# Altium project novena_battery1.PrjPcb
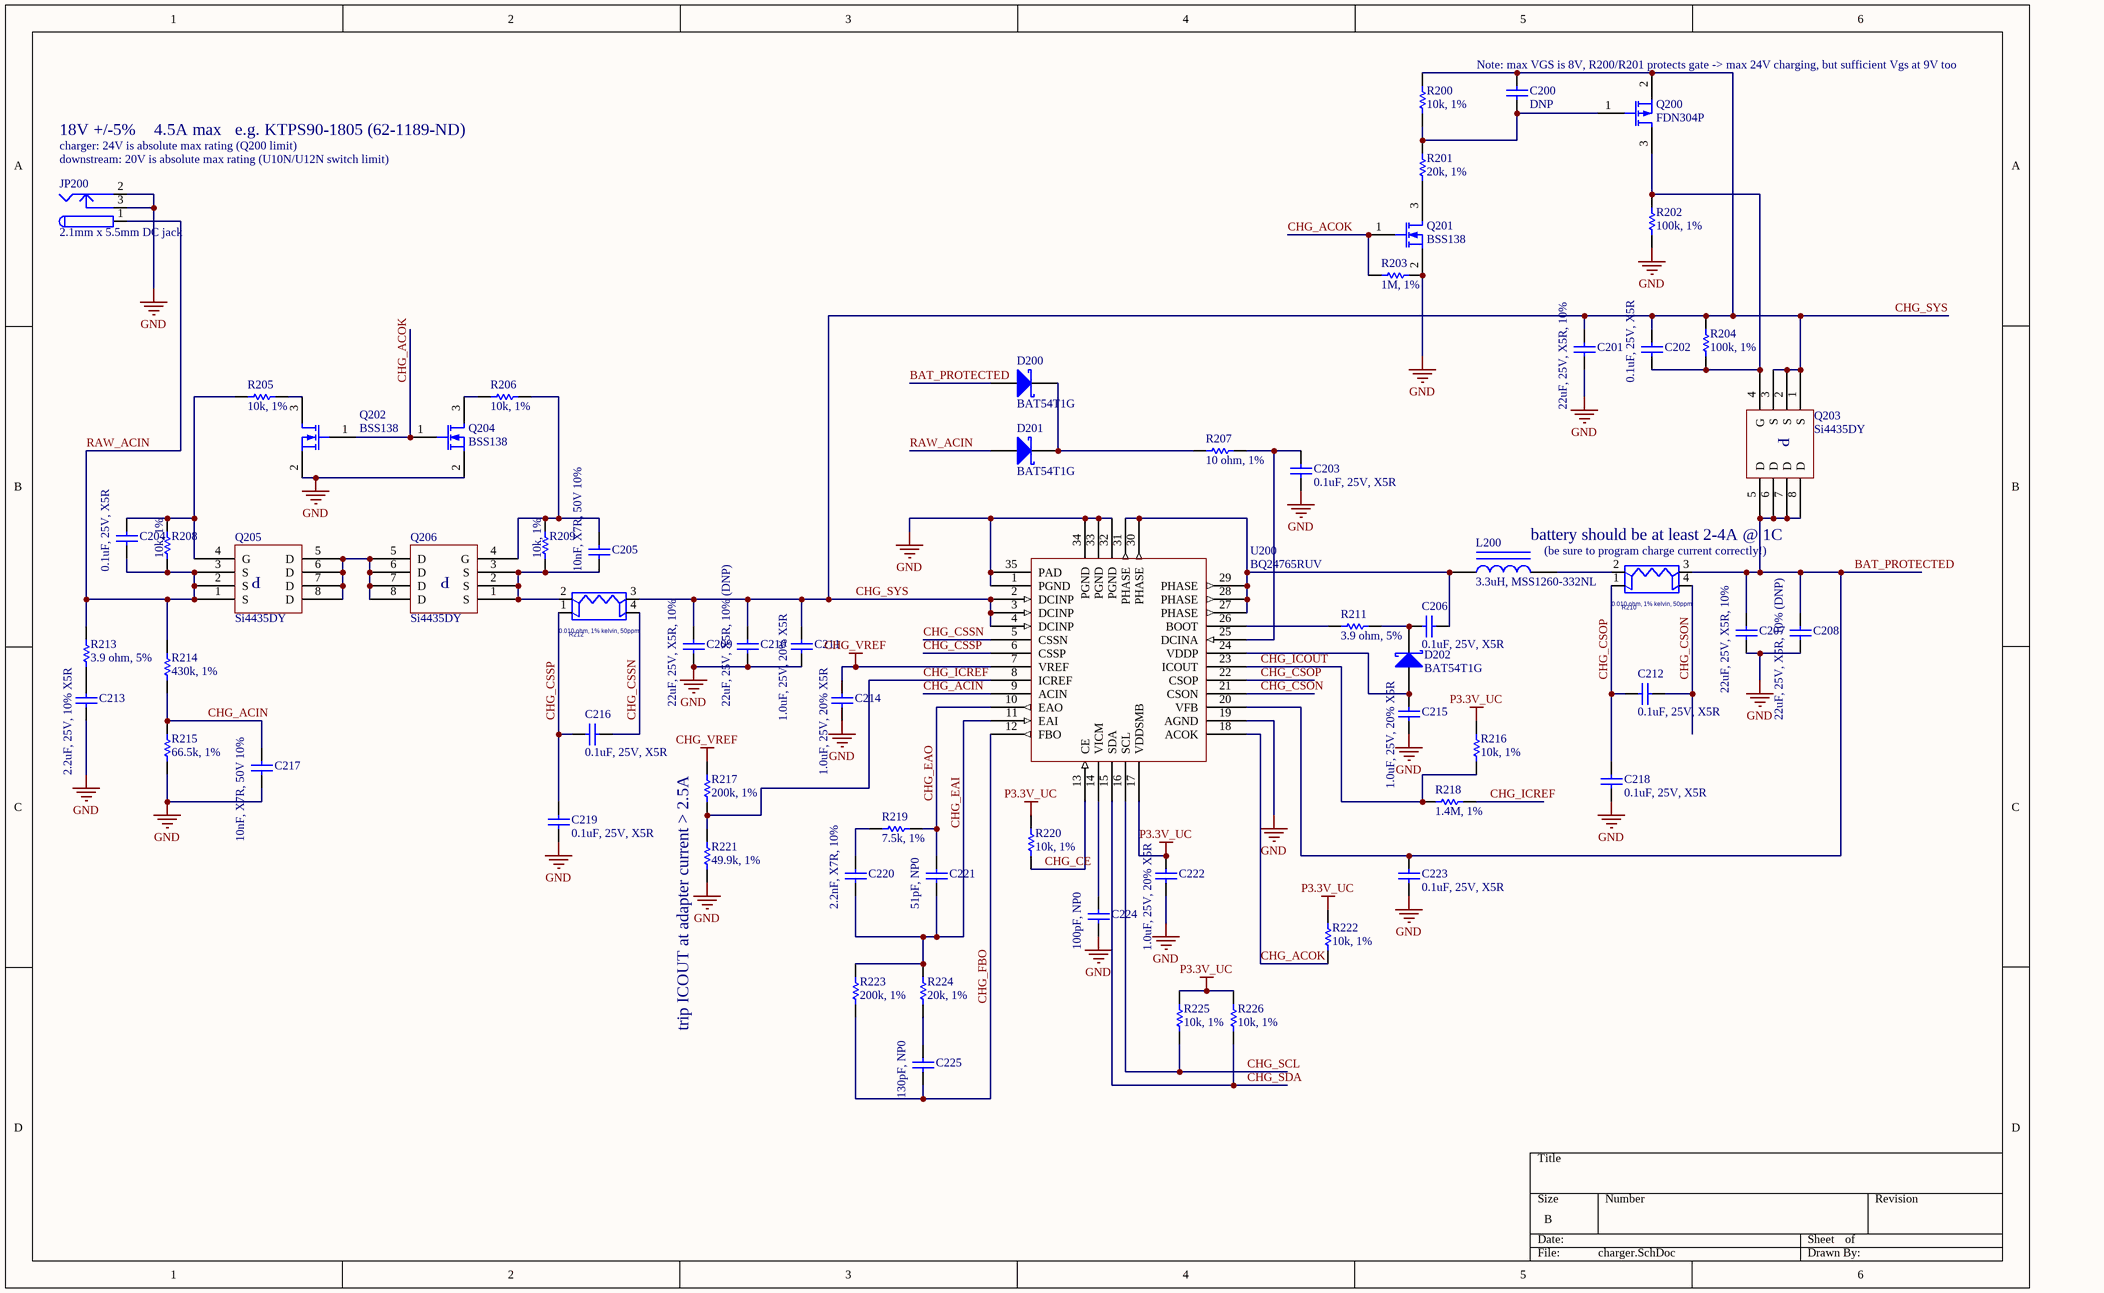
[diagram p0: charger.SchDoc]
3 sheets, 205 parts. Net scope: global (net labels, ports and power ports of the same name join across sheets).
Board file: novena_battery_evt1a.PcbDoc
Sheets:
  charger.SchDoc
  battery.SchDoc
  controller.SchDoc

## Sheet charger.SchDoc
size B

### Parts
C200  DNP  [CAPC1005N]
C201  22uF, 25V, X5R, 10%  [CAPC3225N]
C202  0.1uF, 25V, X5R  [CAPC1005N]
C203  0.1uF, 25V, X5R  [CAPC1005N]
C204  0.1uF, 25V, X5R  [CAPC1005N]
C205  10nF, X7R, 50V 10%  [CAPC1005N]
C206  0.1uF, 25V, X5R  [CAPC1005N]
C207  22uF, 25V, X5R, 10%  [CAPC3225N]
C208  22uF, 25V, X5R, 10% (DNP)  [CAPC3225N]
C209  22uF, 25V, X5R, 10%  [CAPC3225N]
C210  22uF, 25V, X5R, 10% (DNP)  [CAPC3225N]
C211  1.0uF, 25V, 20% X5R  [CAPC1608N]
C212  0.1uF, 25V, X5R  [CAPC1005N]
C213  2.2uF, 25V, 10% X5R  [CAPC1608N]
C214  1.0uF, 25V, 20% X5R  [CAPC1608N]
C215  1.0uF, 25V, 20% X5R  [CAPC1608N]
C216  0.1uF, 25V, X5R  [CAPC1005N]
C217  10nF, X7R, 50V 10%  [CAPC1005N]
C218  0.1uF, 25V, X5R  [CAPC1005N]
C219  0.1uF, 25V, X5R  [CAPC1005N]
C220  2.2nF, X7R, 10%  [CAPC1005N]
C221  51pF, NP0  [CAPC1005N]
C222  1.0uF, 25V, 20% X5R  [CAPC1608N]
C223  0.1uF, 25V, X5R  [CAPC1005N]
C224  100pF, NP0  [CAPC1005N]
C225  130pF, NP0  [CAPC1005N]
D200  BAT54T1G  [SOD123]
D201  BAT54T1G  [SOD123]
D202  BAT54T1G  [SOD123]
JP200  2.1mm x 5.5mm DC jack  [CUI_PJ_002AH_SMT]
L200  3.3uH, MSS1260-332NL  [COILCRAFT_MSS1048]
Q200  FDN304P  [SOT23-3N]
Q201  BSS138  [SOT23-3N]
Q202  BSS138  [SOT23-3N]
Q203  Si4435DY  [SOIC127P600-8AN]
Q204  BSS138  [SOT23-3N]
Q205  Si4435DY  [SOIC127P600-8AN]
Q206  Si4435DY  [SOIC127P600-8AN]
R200  10k, 1%  [RESC1005N]
R201  20k, 1%  [RESC1005N]
R202  100k, 1%  [RESC1005N]
R203  1M, 1%  [RESC1005N]
R204  100k, 1%  [RESC1005N]
R205  10k, 1%  [RESC1005N]
R206  10k, 1%  [RESC1005N]
R207  10 ohm, 1%  [RESC1005N]
R208  10k, 1%  [RESC1005N]
R209  10k, 1%  [RESC1005N]
R210  0.010 ohm, 1% kelvin, 50ppm  [OHMITE_LVK_1206_KELVIN]
R211  3.9 ohm, 5%  [RESC1005N]
R212  0.010 ohm, 1% kelvin, 50ppm  [OHMITE_LVK_1206_KELVIN]
R213  3.9 ohm, 5%  [RESC1005N]
R214  430k, 1%  [RESC1005N]
R215  66.5k, 1%  [RESC1005N]
R216  10k, 1%  [RESC1005N]
R217  200k, 1%  [RESC1005N]
R218  1.4M, 1%  [RESC1005N]
R219  7.5k, 1%  [RESC1005N]
R220  10k, 1%  [RESC1005N]
R221  49.9k, 1%  [RESC1005N]
R222  10k, 1%  [RESC1005N]
R223  200k, 1%  [RESC1005N]
R224  20k, 1%  [RESC1005N]
R225  10k, 1%  [RESC1005N]
R226  10k, 1%  [RESC1005N]
U200  BQ24765RUV  [TI_R-PVQFN-N34]

### Nets
CHG_VREF: C214.1 R217.1 U200.7(VREF)
GND: C201.2 C203.2 C207.2 C208.2 C209.2 C210.2 C211.2 C213.2 C214.2 C215.2 C217.2 C218.1 C219.2 C222.2 C223.1 C224.2 JP200.2 JP200.3 Q201.2(S) Q202.2(S) Q204.2(S) R202.2 R203.1 R215.2 R221.2 U200.1(PGND) U200.19(AGND) U200.32(PGND) U200.33(PGND) U200.34(PGND) U200.35(PAD)
P3.3V_UC: C222.1 R216.1 R220.1 R222.1 R225.1 R226.1 U200.17(VDDSMB)
BAT_PROTECTED: C207.1 C208.1 C223.2 D200.1(A) Q203.5(D) Q203.6(D) Q203.7(D) Q203.8(D) R210.3 U200.20(VFB)
CHG_ACIN: C217.1 R214.2 R215.1 U200.9(ACIN)
CHG_ACOK: Q201.1(G) Q202.1(G) Q204.1(G) R203.2 R222.2 U200.18(ACOK)
CHG_CE: R220.2 U200.13(CE)
CHG_CSON: C212.1 R210.4 U200.21(CSON)
CHG_CSOP: C212.2 C218.2 R210.1 U200.22(CSOP)
CHG_CSSN: C216.2 R212.4 U200.5(CSSN)
CHG_CSSP: C216.1 C219.1 R212.1 U200.6(CSSP)
CHG_EAI: C220.2 C221.2 R223.1 R224.1 U200.11(EAI)
CHG_EAO: C221.1 R219.2 U200.10(EAO)
CHG_FBO: C225.2 R223.2 U200.12(FBO)
CHG_ICOUT: R216.2 R218.2 U200.23(ICOUT)
CHG_ICREF: R217.2 R218.1 R221.1 U200.8(ICREF)
CHG_SCL: R225.2 U200.16(SCL)
CHG_SDA: R226.2 U200.15(SDA)
CHG_SYS: C200.2 C201.1 C202.1 C209.1 C210.1 C211.1 Q200.2(S) Q203.1(S) Q203.2(S) Q203.3(S) R200.1 R204.1 R212.3 U200.2(DCINP) U200.3(DCINP) U200.4(DCINP)
RAW_ACIN: C204.2 D201.1(A) JP200.1 Q205.1(S) Q205.2(S) Q205.3(S) R208.1 R213.1 R214.1
NetC200_1: C200.1 Q200.1(G) R200.2 R201.1
NetC202_2: C202.2 Q200.3(D) Q203.4(G) R202.1 R204.2
NetC203_1: C203.1 R207.2 U200.25(DCINA)
NetC204_1: C204.1 Q205.4(G) R205.1 R208.2
NetC205_1: C205.1 Q206.4(G) R206.2 R209.2
NetC205_2: C205.2 Q206.1(S) Q206.2(S) Q206.3(S) R209.1 R212.2
NetC206_1: C206.1 D202.2(K) R211.2
NetC206_2: C206.2 L200.1 U200.27(PHASE) U200.28(PHASE) U200.29(PHASE) U200.30(PHASE) U200.31(PHASE)
NetC213_1: C213.1 R213.2
NetC215_1: C215.1 D202.1(A) U200.24(VDDP)
NetC220_1: C220.1 R219.1
NetC224_1: C224.1 U200.14(VICM)
NetC225_1: C225.1 R224.2
NetD200_2: D200.2(K) D201.2(K) R207.1
NetL200_2: L200.2 R210.2
NetQ201_3: Q201.3(D) R201.2
NetQ202_3: Q202.3(D) R205.2
NetQ204_3: Q204.3(D) R206.1
NetQ205_5: Q205.5(D) Q205.6(D) Q205.7(D) Q205.8(D) Q206.5(D) Q206.6(D) Q206.7(D) Q206.8(D)
NetR211_1: R211.1 U200.26(BOOT)

### Notes on the sheet
- (near C200) Note: max VGS is 8V, R200/R201 protects gate -> max 24V charging, but sufficient Vgs at 9V too
- 18V +/-5%
- (near JP200) charger: 24V is absolute max rating (Q200 limit)
- (near JP200) downstream: 20V is absolute max rating (U10N/U12N switch limit)
- 4.5A max
- e.g. KTPS90-1805 (62-1189-ND)
- battery should be at least 2-4A @ 1C
- (be sure to program charge current correctly!)
- trip ICOUT at adapter current > 2.5A
- (in symbol Si4435DY) P

### Library data of the parts
C200-C225 = Cap Semi: Capacitor (Semiconductor SIM Model); Published: 8-Jun-2000; LatestRevisionDate: 17-Jul-2002; LatestRevisionNote: Re-released for DXP Platform.; PackageReference: C1206; Publisher: Altium Limited
D200-D202 = D Schottky: Schottky Diode; Code - JEDEC: DO-214-AA; Published: 8-Jun-2000; Publisher: Altium Limited; Revision: July-2002: Re-released for DXP Platform.
JP200 = PWR2.5: Low Voltage Power Supply Connector; Published: 17-Dec-2003; Datasheet: Latest Revision: 09-May-2002; Publisher: Altium Limited
L200 = Inductor Iron: Magnetic-Core Inductor; Published: 24-Mar-1999; LatestRevisionDate: 17-Jul-2002; LatestRevisionNote: Re-released for DXP Platform.; PackageReference: AXIAL-0.9; Publisher: Altium Limited
Q200 = MOSFET-P: P-Channel MOSFET; Published: 8-Jun-2000; LatestRevisionDate: 17-Jul-2002; LatestRevisionNote: Re-released for DXP Platform.; PackageVersion: 1995/1996; PackageReference: E3; Publisher: Altium Limited; PackageDescription: TO, Flat Index; 3 In-Line, Axial Leads; Body Dia. 4.6mm; Lead Dia. 0.5 mm (max)
Q201 Q202 Q204 = MOSFET-N: N-Channel MOSFET; Published: 8-Jun-2000; LatestRevisionDate: 17-Jul-2002; LatestRevisionNote: Re-released for DXP Platform.; PackageVersion: 1995/1996; PackageReference: E3; Publisher: Altium Limited
Q203 Q205 Q206 = Si4435DY: Singre P-channel FET, 8A, 30V
R200 R201 R203 R205-R209 R211 R213-R226 = Res1: Resistor; Value: 100k; Published: 8-Jun-2000; LatestRevisionDate: 17-Jul-2002; LatestRevisionNote: Re-released for DXP Platform.; PackageReference: AXIAL-0.3; Publisher: Altium Limited
R202 R204 = Res1: Resistor; Published: 8-Jun-2000; LatestRevisionDate: 17-Jul-2002; LatestRevisionNote: Re-released for DXP Platform.; PackageReference: AXIAL-0.3; Publisher: Altium Limited; Value: 100k
R210 R212 = RES_4TERM: PART_NUMBER: R00034-001; CDS_LMAN_SYM_OUTLINE: -100,25,100,-75; NEEDS_NO_SIZE: TRUE; PATH: I224; PN: #; OriginalSymbolOrigin: (-100,50); LOCATION: RN32; SEC: 1; XY: (-5650,2000); WATTAGE: 1/2W; PHYS_PAGE: 12; PACK_TYPE: RES1206_4T; MFG_PN: LVK12R020FER; MFG: OHMITE; DRAWING: @BROWNSTONE_LIB.BROWNSTONE(SCH_1):PAGE12; CDS_LIB: resistors; MATERIAL: CH; TOLERANCE: ?; VER: 1; TOL: 1%; ROT: 1; CDS_SEC: 1; CDS_LOCATION: RN32; $TOLERANCE: ?; $SEC: 1; $PN: #; $LOCATION: RN32
U200 = BQ24765RUV: SMBus-controlled battery charger with integrated FETs

## Sheet battery.SchDoc
size B
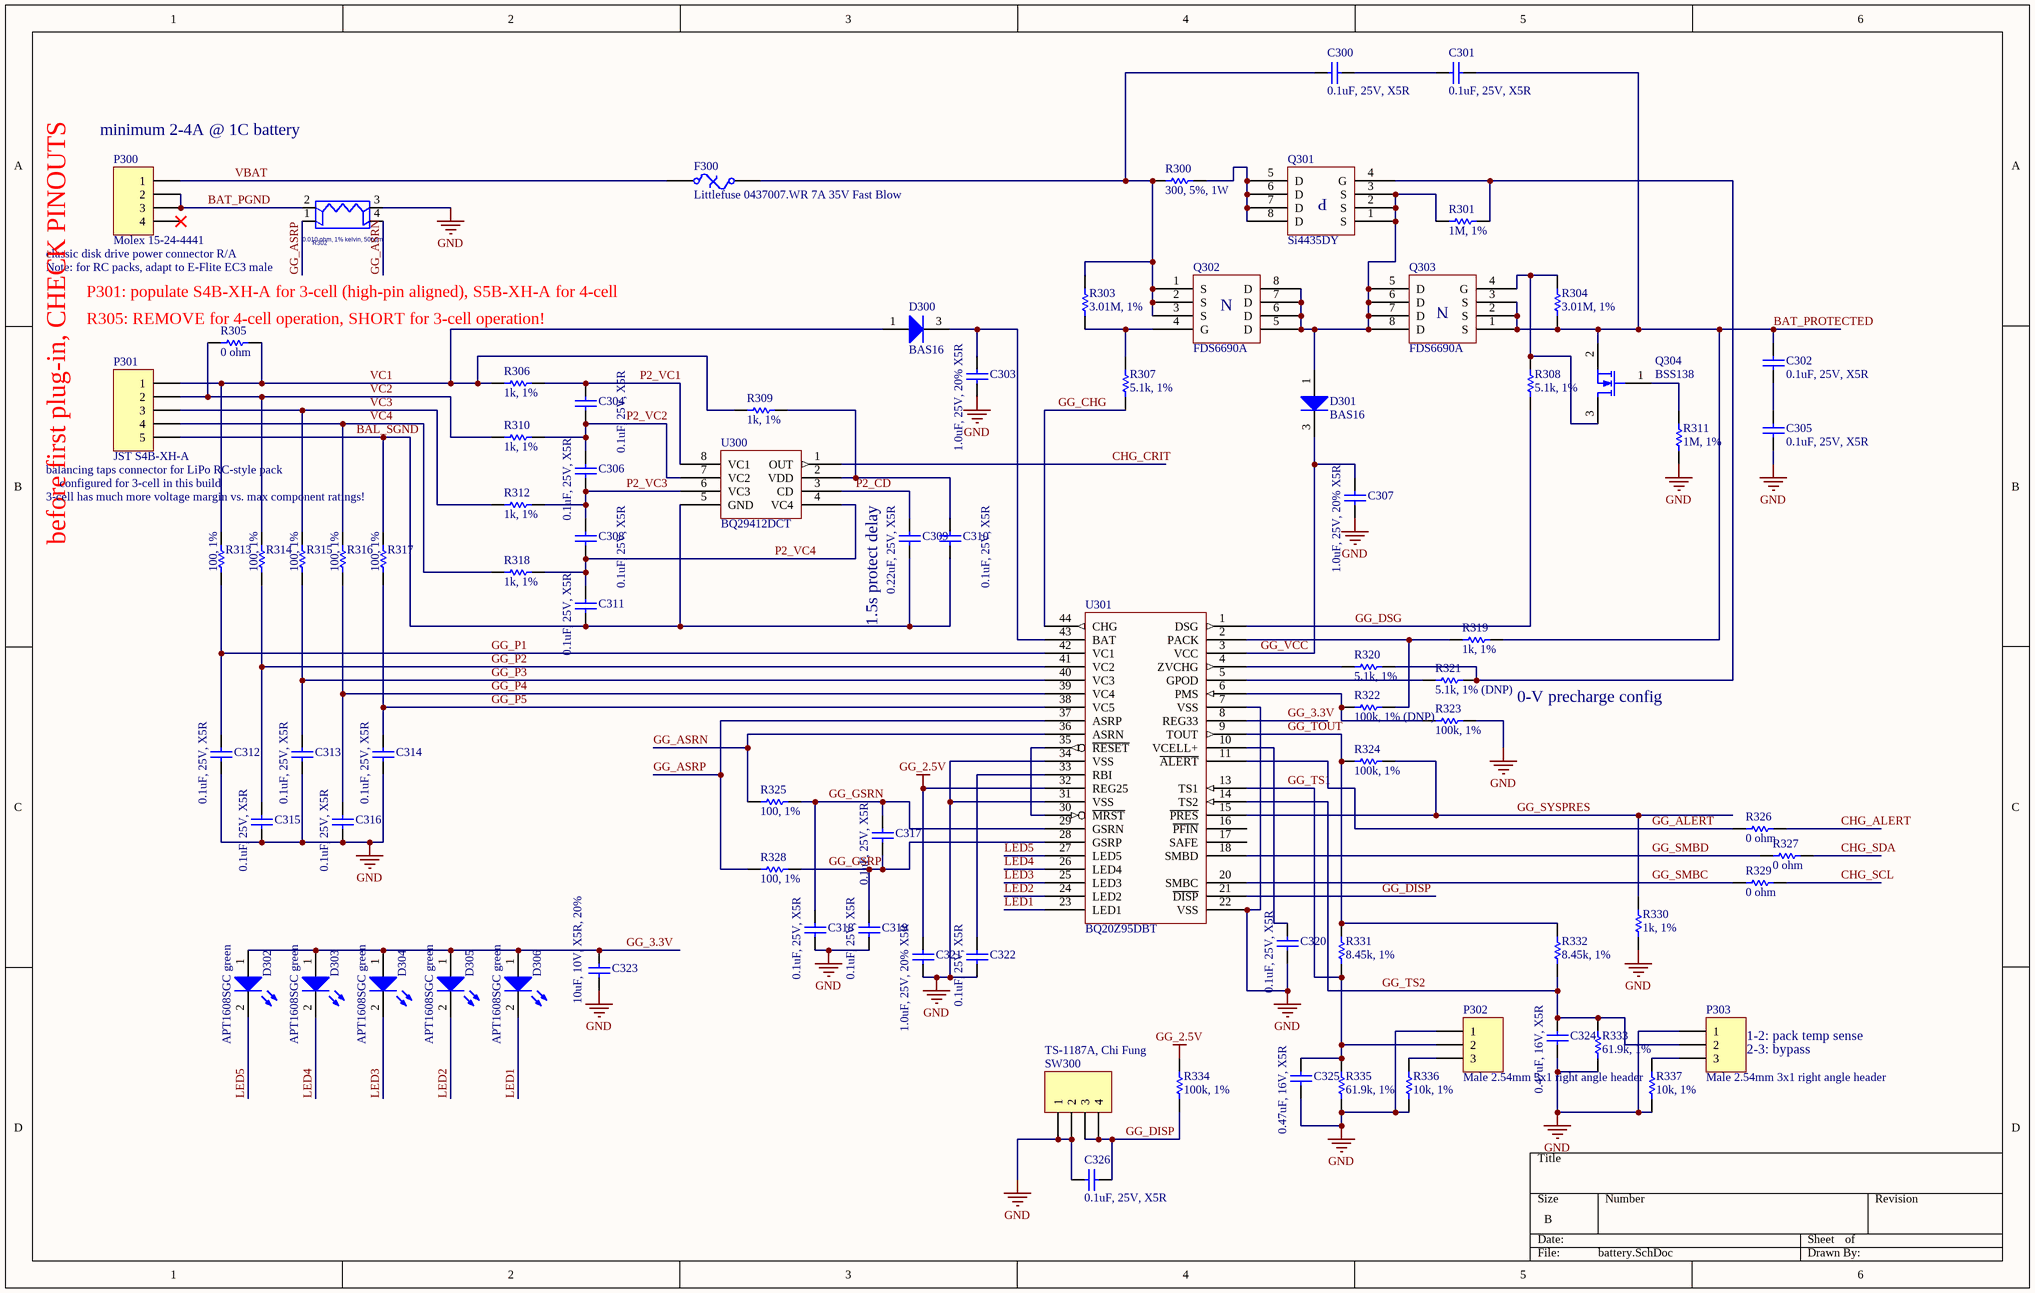
[diagram p1: battery.SchDoc]

### Parts
C300  0.1uF, 25V, X5R  [CAPC1005N]
C301  0.1uF, 25V, X5R  [CAPC1005N]
C302  0.1uF, 25V, X5R  [CAPC1005N]
C303  1.0uF, 25V, 20% X5R  [CAPC1608N]
C304  0.1uF, 25V, X5R  [CAPC1005N]
C305  0.1uF, 25V, X5R  [CAPC1005N]
C306  0.1uF, 25V, X5R  [CAPC1005N]
C307  1.0uF, 25V, 20% X5R  [CAPC1608N]
C308  0.1uF, 25V, X5R  [CAPC1005N]
C309  0.22uF, 25V, X5R  [CAPC1005N]
C310  0.1uF, 25V, X5R  [CAPC1005N]
C311  0.1uF, 25V, X5R  [CAPC1005N]
C312  0.1uF, 25V, X5R  [CAPC1005N]
C313  0.1uF, 25V, X5R  [CAPC1005N]
C314  0.1uF, 25V, X5R  [CAPC1005N]
C315  0.1uF, 25V, X5R  [CAPC1005N]
C316  0.1uF, 25V, X5R  [CAPC1005N]
C317  0.1uF, 25V, X5R  [CAPC1005N]
C318  0.1uF, 25V, X5R  [CAPC1005N]
C319  0.1uF, 25V, X5R  [CAPC1005N]
C320  0.1uF, 25V, X5R  [CAPC1005N]
C321  1.0uF, 25V, 20% X5R  [CAPC1608N]
C322  0.1uF, 25V, X5R  [CAPC1005N]
C323  10uF, 10V, X5R, 20%  [CAPC1608N]
C324  0.47uF, 16V, X5R  [CAPC1005N]
C325  0.47uF, 16V, X5R  [CAPC1005N]
C326  0.1uF, 25V, X5R  [CAPC1005N]
D300  BAS16  [SOT23-3N]
D301  BAS16  [SOT23-3N]
D302  APT1608SGC green  [CD1608-0603]
D303  APT1608SGC green  [CD1608-0603]
D304  APT1608SGC green  [CD1608-0603]
D305  APT1608SGC green  [CD1608-0603]
D306  APT1608SGC green  [CD1608-0603]
F300  Littlefuse 0437007.WR 7A 35V Fast Blow  [RESC3216N]
P300  Molex 15-24-4441  [MOLEX_15-24-4441]
P301  JST S4B-XH-A  [JST_S5B-XH-A_OPT4]
P302  Male 2.54mm 3x1 right angle header  [HDR1X3H]
P303  Male 2.54mm 3x1 right angle header  [HDR1X3H]
Q301  Si4435DY  [SOIC127P600-8AN]
Q302  FDS6690A  [SOIC127P600-8AN]
Q303  FDS6690A  [SOIC127P600-8AN]
Q304  BSS138  [SOT23-3N]
R300  300, 5%, 1W  [RESC6432N]
R301  1M, 1%  [RESC1005N]
R302  0.010 ohm, 1% kelvin, 50ppm  [OHMITE_LVK_1206_KELVIN]
R303  3.01M, 1%  [RESC1005N]
R304  3.01M, 1%  [RESC1005N]
R305  0 ohm  [RESC1005N]
R306  1k, 1%  [RESC1005N]
R307  5.1k, 1%  [RESC1005N]
R308  5.1k, 1%  [RESC1005N]
R309  1k, 1%  [RESC1005N]
R310  1k, 1%  [RESC1005N]
R311  1M, 1%  [RESC1005N]
R312  1k, 1%  [RESC1005N]
R313  100, 1%  [RESC1005N]
R314  100, 1%  [RESC1005N]
R315  100, 1%  [RESC1005N]
R316  100, 1%  [RESC1005N]
R317  100, 1%  [RESC1005N]
R318  1k, 1%  [RESC1005N]
R319  1k, 1%  [RESC1005N]
R320  5.1k, 1%  [RESC1005N]
R321  5.1k, 1% (DNP)  [RESC1005N]
R322  100k, 1% (DNP)  [RESC1005N]
R323  100k, 1%  [RESC1005N]
R324  100k, 1%  [RESC1005N]
R325  100, 1%  [RESC1005N]
R326  0 ohm  [RESC1005N]
R327  0 ohm  [RESC1005N]
R328  100, 1%  [RESC1005N]
R329  0 ohm  [RESC1005N]
R330  1k, 1%  [RESC1005N]
R331  8.45k, 1%  [RESC1005N]
R332  8.45k, 1%  [RESC1005N]
R333  61.9k, 1%  [RESC1005N]
R334  100k, 1%  [RESC1005N]
R335  61.9k, 1%  [RESC1005N]
R336  10k, 1%  [RESC1005N]
R337  10k, 1%  [RESC1005N]
SW300  TS-1187A, Chi Fung  [SWITCH_TS-1187A]
U300  BQ29412DCT  [TSOP65P490-8AN]
U301  BQ20Z95DBT  [TSSOP50P640-44N]

### Nets
GG_2.5V: C321.1 R334.2 U301.32(REG25)
GND: C303.2 C305.1 C307.2 C312.2 C313.2 C314.2 C315.2 C316.2 C318.2 C319.2 C320.2 C321.2 C322.2 C323.2 C324.2 C325.2 C326.2 P302.1 P303.1 R302.3 R311.2 R323.2 R330.2 R333.1 R335.1 R336.1 R337.1 SW300.1 SW300.2 U301.7(VSS) U301.22(VSS) U301.31(VSS) U301.34(VSS)
BAL_SGND: C309.2 C310.2 C311.2 P301.5 R317.1 U300.5(GND)
BAT_PGND: P300.2 P300.3 R302.2
BAT_PROTECTED: C301.1 C302.2 Q303.1(S) Q303.2(S) Q303.3(S) Q304.2(S) R304.2 R319.1
CHG_ALERT: R326.2
CHG_CRIT: U300.1(OUT)
CHG_SCL: R329.2
CHG_SDA: R327.2
GG_3.3V: C323.1 D302.1(A) D303.1(A) D304.1(A) D305.1(A) D306.1(A) U301.8(REG33)
GG_ALERT: R326.1 U301.11(~{ALERT})
GG_ASRN: R302.4 R325.2 U301.36(ASRN)
GG_ASRP: R302.1 R328.2 U301.37(ASRP)
GG_CHG: R307.2 U301.44(CHG)
GG_DISP: C326.1 R334.1 SW300.3 SW300.4 U301.21(~{DISP})
GG_DSG: R308.2 U301.1(DSG)
GG_GSRN: C317.1 C318.1 R325.1 U301.29(GSRN)
GG_GSRP: C317.2 C319.1 R328.1 U301.28(GSRP)
GG_P1: C312.1 R313.2 U301.42(VC1)
GG_P2: C315.1 R314.2 U301.41(VC2)
GG_P3: C313.1 R315.2 U301.40(VC3)
GG_P4: C316.1 R316.2 U301.39(VC4)
GG_P5: C314.1 R317.2 U301.38(VC5)
GG_SMBC: R329.1 U301.20(SMBC)
GG_SMBD: R327.1 U301.18(SMBD)
GG_SYSPRES: R324.2 R330.1 U301.15(~{PRES})
GG_TOUT: R324.1 R331.2 R332.2 U301.9(TOUT)
GG_TS1: C325.1 P302.2 R331.1 R335.2 U301.13(TS1)
GG_TS2: C324.1 P303.2 R332.1 R333.2 U301.14(TS2)
GG_VCC: C307.1 D301.3(K) U301.3(VCC)
LED1: D306.2(K) U301.23(LED1)
LED2: D305.2(K) U301.24(LED2)
LED3: D304.2(K) U301.25(LED3)
LED4: D303.2(K) U301.26(LED4)
LED5: D302.2(K) U301.27(LED5)
P2_CD: C309.1 U300.3(CD)
P2_VC1: C304.1 R306.2 U300.8(VC1)
P2_VC2: C304.2 C306.1 R310.2 U300.7(VC2)
P2_VC3: C306.2 C308.1 R312.2 U300.6(VC3)
P2_VC4: C308.2 C311.1 R318.2 U300.4(VC4)
VBAT: F300.1 P300.1
VC1: D300.1(A) P301.1 R305.2 R306.1 R309.1 R313.1
VC2: P301.2 R305.1 R310.1 R314.1
VC3: P301.3 R312.1 R315.1
VC4: P301.4 R316.1 R318.1
NetC300_1: C300.1 C301.2
NetC300_2: C300.2 F300.2 Q302.1(S) Q302.2(S) Q302.3(S) R300.2 R303.1
NetC302_1: C302.1 C305.2
NetC303_1: C303.1 D300.3(K) U301.43(BAT)
NetC310_1: C310.1 R309.2 U300.2(VDD)
NetC320_1: C320.1 U301.10(VCELL+)
NetC322_1: C322.1 U301.33(RBI)
NetD301_1: D301.1(A) Q301.1(S) Q301.2(S) Q301.3(S) Q302.5(D) Q302.6(D) Q302.7(D) Q302.8(D) Q303.5(D) Q303.6(D) Q303.7(D) Q303.8(D) R301.2
NetP302_3: P302.3 R336.2
NetP303_3: P303.3 R337.2
NetQ301_4: Q301.4(G) R301.1 R320.1 R321.1
NetQ301_5: Q301.5(D) Q301.6(D) Q301.7(D) Q301.8(D) R300.1
NetQ302_4: Q302.4(G) R303.2 R307.1
NetQ303_4: Q303.4(G) Q304.3(D) R304.1 R308.1
NetQ304_1: Q304.1(G) R311.1
NetR319_2: R319.2 R322.2 U301.2(PACK)
NetR320_2: R320.2 U301.4(ZVCHG)
NetR321_2: R321.2 U301.5(GPOD)
NetR322_1: R322.1 R323.1 U301.6(PMS)
NetU301_30: U301.30(~{MRST}) U301.35(~{RESET})

Not connected (* = marked no-connect by the designer): P300 4*; U301 16(~{PFIN}) 17(SAFE)

### Notes on the sheet
- (near P300) minimum 2-4A @ 1C battery
- (near P300) classic disk drive power connector R/A
- Note: for RC packs, adapt to E-Flite EC3 male
- P301: populate S4B-XH-A for 3-cell (high-pin aligned), S5B-XH-A for 4-cell
- (near R305) R305: REMOVE for 4-cell operation, SHORT for 3-cell operation!
- (near P301) balancing taps connector for LiPo RC-style pack
- 3-cell has much more voltage margin vs. max component ratings!
- configured for 3-cell in this build
- before first plug-in, CHECK PINOUTS
- (near C309) 1.5s protect delay
- 0-V precharge config
- (near P303) 1-2: pack temp sense
- (near P303) 2-3: bypass
- (in symbol FDS6690A) N
- (in symbol Si4435DY) P

### Library data of the parts
C300-C326 = Cap Semi: Capacitor (Semiconductor SIM Model); Published: 8-Jun-2000; LatestRevisionDate: 17-Jul-2002; LatestRevisionNote: Re-released for DXP Platform.; PackageReference: C1206; Publisher: Altium Limited
D300 D301 = Diode 1N4148: Silicon diode; Published: 8-Jun-2000; LatestRevisionDate: 17-Jul-2002; LatestRevisionNote: Re-released for DXP Platform.; DatasheetVersion: 1997; PackageReference: DO-35; Publisher: Altium Limited; PackageDescription: Diode, Axial; Body 3.8 x 1.9 mm (LxDia. max), Lead Dia. 0.53 mm (max); Code_JEDEC: DO-204-AH; ComponentLink1Description: Manufacturer Link; ComponentLink1URL: http://www.fairchildsemi.com/; ComponentLink2Description: Datasheet; ComponentLink2URL: http://www.fairchildsemi.com/ds/1N%2F1N4148.pdf
D302-D306 = LED2: Typical RED, GREEN, YELLOW, AMBER GaAs LED; Published: 8-Jun-2000; LatestRevisionDate: 17-Jul-2002; LatestRevisionNote: Re-released for DXP Platform.; PackageVersion: Feb-2002; PackageReference: 3.2X1.6X1.1; Publisher: Altium Limited
F300 = Fuse Thermal: Thermal Fuse; Published: 24-Mar-1999; Revision: July-2002: Re-released for DXP Platform.; Publisher: Altium Limited
P300 = Header 4: Classic PC hard drive power connector, RA; LatestRevisionDate: 17-Jul-2002; LatestRevisionNote: Re-released for DXP Platform.; Publisher: Altium Limited
P301 = Header 5: JST S4B-XH-A 2.5mm RA connector, stuffed in 5-pin slot, high pin aligned; LatestRevisionDate: 17-Jul-2002; LatestRevisionNote: Re-released for DXP Platform.; Publisher: Altium Limited
P302 P303 = Header 3H: Header, 3-Pin, Right Angle; LatestRevisionDate: 17-Jul-2002; LatestRevisionNote: Re-released for DXP Platform.; Publisher: Altium Limited
Q301 = Si4435DY: Singre P-channel FET, 8A, 30V
Q302 Q303 = FDS6690A: Single N-channel FET, 11A, 30V
Q304 = MOSFET-N: N-Channel MOSFET; Published: 8-Jun-2000; LatestRevisionDate: 17-Jul-2002; LatestRevisionNote: Re-released for DXP Platform.; PackageVersion: 1995/1996; PackageReference: E3; Publisher: Altium Limited
R300 R301 R303-R321 R325-R333 R335-R337 = Res1: Resistor; Value: 100k; Published: 8-Jun-2000; LatestRevisionDate: 17-Jul-2002; LatestRevisionNote: Re-released for DXP Platform.; PackageReference: AXIAL-0.3; Publisher: Altium Limited
R302 = RES_4TERM: as R210 on sheet charger; MATERIAL: CH; TOLERANCE: ?; VER: 1; TOL: 1%; ROT: 1; CDS_SEC: 1; CDS_LOCATION: RN32; $TOLERANCE: ?; $SEC: 1; $PN: #; $LOCATION: RN32
R322-R324 R334 = Res1: Resistor; Published: 8-Jun-2000; LatestRevisionDate: 17-Jul-2002; LatestRevisionNote: Re-released for DXP Platform.; PackageReference: AXIAL-0.3; Publisher: Altium Limited; Value: 100k
SW300 = Header 4: Chi Fung TS-1187A; LatestRevisionDate: 17-Jul-2002; LatestRevisionNote: Re-released for DXP Platform.; Publisher: Altium Limited
U300 = BQ2941XDCT: Voltage protection for 2-,3-, and 4-cell LiIon batteries (2nd level)
U301 = BQ20Z95DBT: SBS 1.1-Compliant Gas Gauge and Protection with Impedance Track (TM)

## Sheet controller.SchDoc
size B
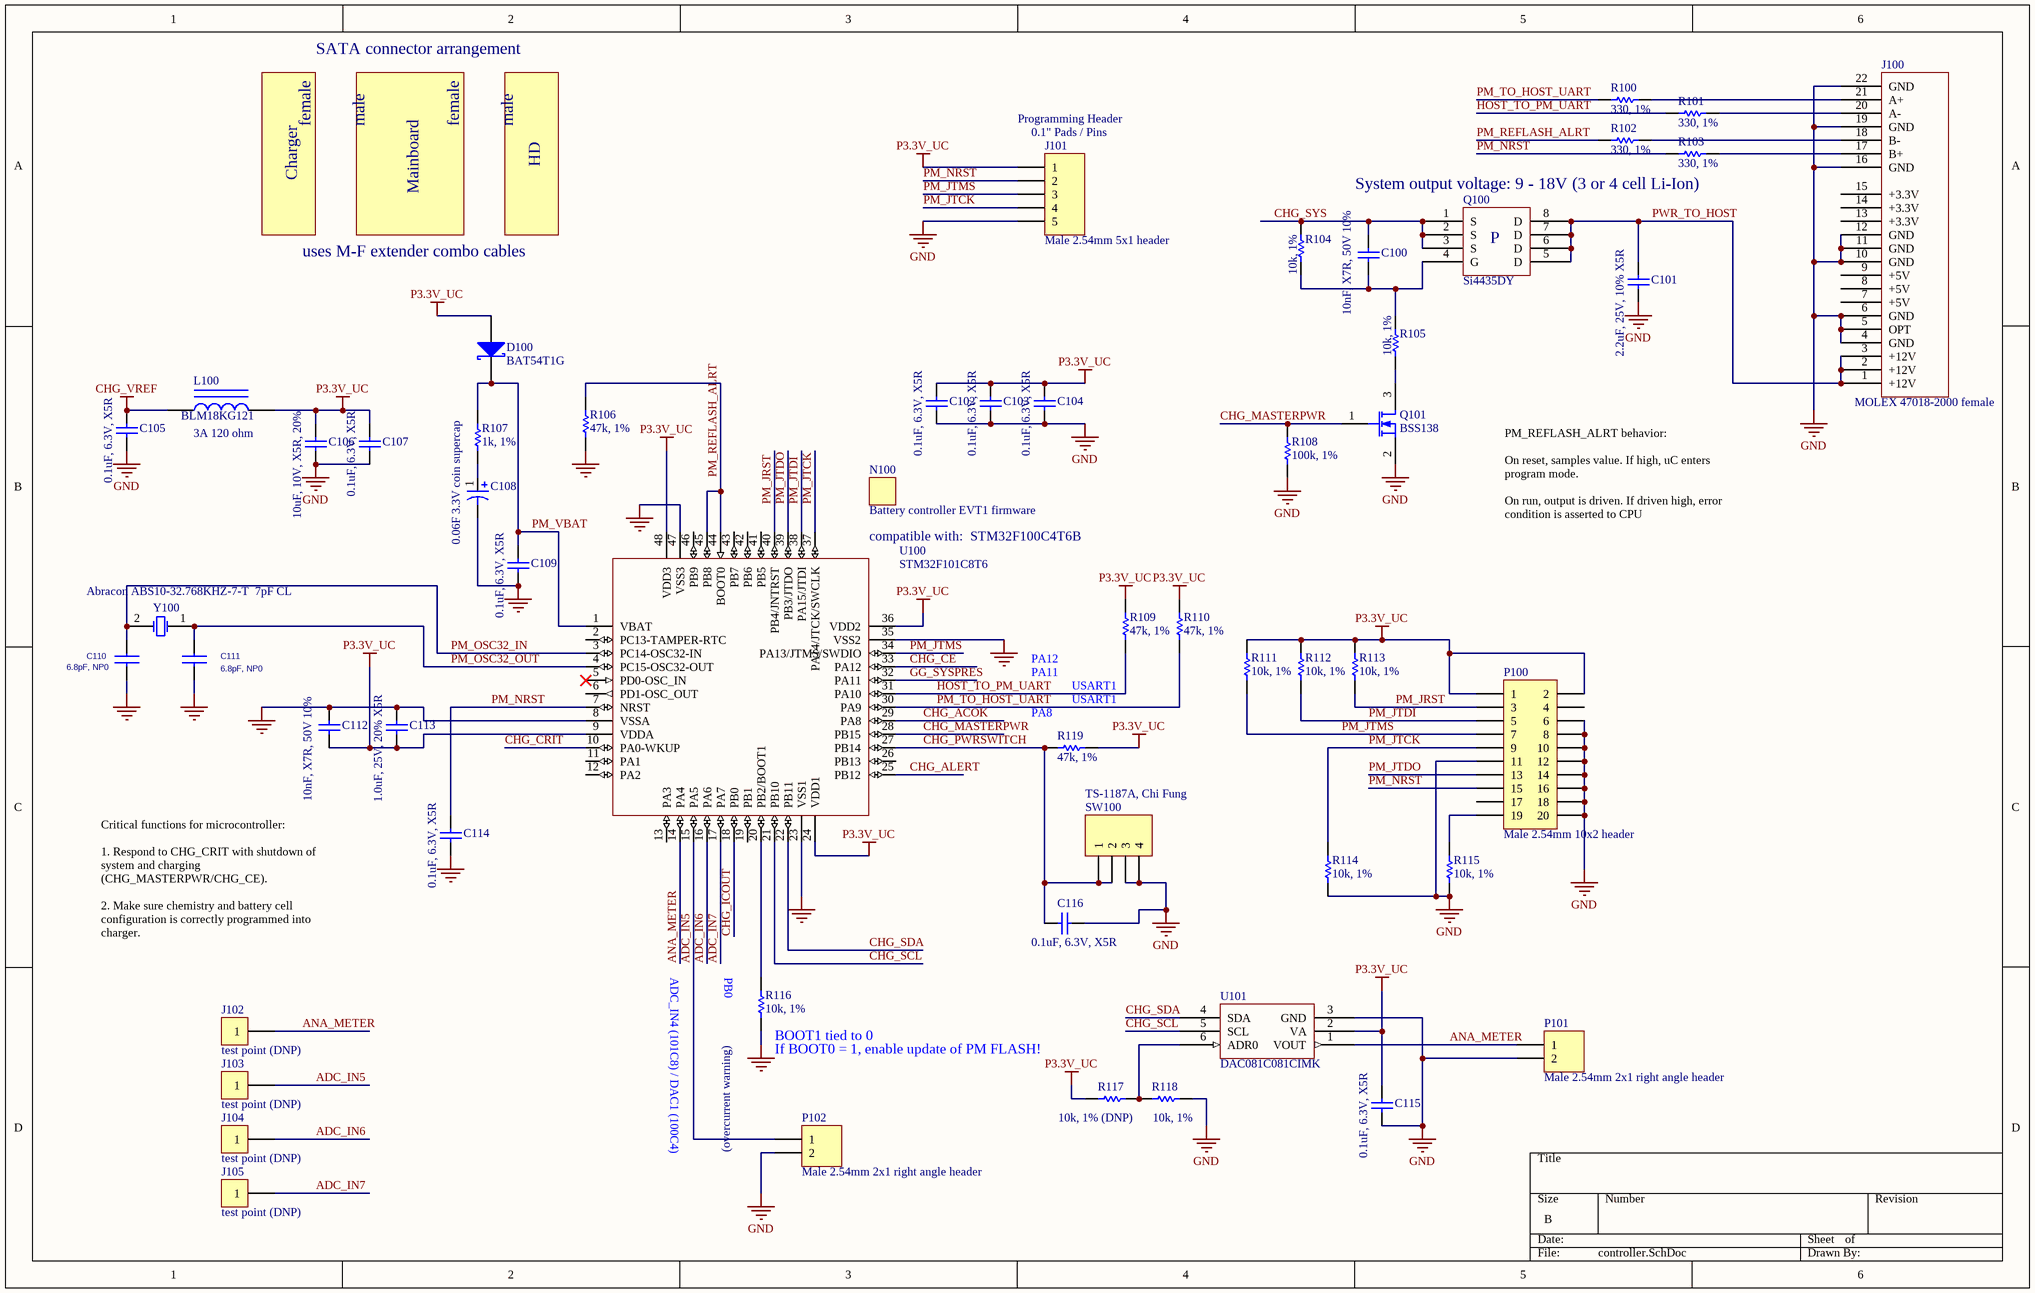
[diagram p2: controller.SchDoc]

### Parts
C100  10nF, X7R, 50V 10%  [CAPC1005N]
C101  2.2uF, 25V, 10% X5R  [CAPC1608N]
C102  0.1uF, 6.3V, X5R  [CAPC0603N_B]
C103  0.1uF, 6.3V, X5R  [CAPC0603N_B]
C104  0.1uF, 6.3V, X5R  [CAPC0603N_B]
C105  0.1uF, 6.3V, X5R  [CAPC0603N_B]
C106  10uF, 10V, X5R, 20%  [CAPC1608N]
C107  0.1uF, 6.3V, X5R  [CAPC0603N_B]
C108  0.06F 3.3V coin supercap  [TAIYO_YUDEN_PAS414HR-VA5R]
C109  0.1uF, 6.3V, X5R  [CAPC0603N_B]
C110  6.8pF, NP0  [CAPC1005N]
C111  6.8pF, NP0  [CAPC1005N]
C112  10nF, X7R, 50V 10%  [CAPC1005N]
C113  1.0uF, 25V, 20% X5R  [CAPC1608N]
C114  0.1uF, 6.3V, X5R  [CAPC0603N_B]
C115  0.1uF, 6.3V, X5R  [CAPC0603N_B]
C116  0.1uF, 6.3V, X5R  [CAPC0603N_B]
D100  BAT54T1G  [SOD123]
J100  MOLEX 47018-2000 female  [SATA_MOLEX_47018_2000]
J101  Male 2.54mm 5x1 header  [HDR1X5]
J102  test point (DNP)  [TP_SMT_38mil]
J103  test point (DNP)  [TP_SMT_38mil]
J104  test point (DNP)  [TP_SMT_38mil]
J105  test point (DNP)  [TP_SMT_38mil]
L100  BLM18KG121  value 3A 120 ohm  [INDC1608AN]
N100  Battery controller EVT1 firmware
P100  Male 2.54mm 10x2 header  [HDR2X10]
P101  Male 2.54mm 2x1 right angle header  [HDR1X2H]
P102  Male 2.54mm 2x1 right angle header  [HDR1X2H]
Q100  Si4435DY  [SOIC127P600-8AN]
Q101  BSS138  [SOT23-3N]
R100  330, 1%  [RESC1005N]
R101  330, 1%  [RESC1005N]
R102  330, 1%  [RESC1005N]
R103  330, 1%  [RESC1005N]
R104  10k, 1%  [RESC1005N]
R105  10k, 1%  [RESC1005N]
R106  47k, 1%  [RESC1005N]
R107  1k, 1%  [RESC1005N]
R108  100k, 1%  [RESC1005N]
R109  47k, 1%  [RESC1005N]
R110  47k, 1%  [RESC1005N]
R111  10k, 1%  [RESC1005N]
R112  10k, 1%  [RESC1005N]
R113  10k, 1%  [RESC1005N]
R114  10k, 1%  [RESC1005N]
R115  10k, 1%  [RESC1005N]
R116  10k, 1%  [RESC1005N]
R117  10k, 1% (DNP)  [RESC1005N]
R118  10k, 1%  [RESC1005N]
R119  47k, 1%  [RESC1005N]
SW100  TS-1187A, Chi Fung  [SWITCH_TS-1187A]
U100  STM32F101C8T6  [TSQFP50P900X900-48N]
U101  DAC081C081CIMK  [SOT26A-6N]
Y100  Abracon ABS10-32.768KHZ-7-T  7pF CL  [ABS10-32.768KHZ]

### Nets
CHG_VREF: C105.1 L100.1
GND: C101.2 C102.2 C103.2 C104.2 C105.2 C106.2 C107.2 C108.2 C109.2 C110.2 C111.2 C112.1 C113.1 C114.2 C115.2 C116.1 J100.4(GND) J100.5(OPT) J100.6(GND) J100.10(GND) J100.11(GND) J100.12(GND) J100.16(GND) J100.19(GND) J100.22(GND) J101.5 P100.6 P100.8 P100.10 P100.11 P100.12 P100.14 P100.16 P100.18 P100.20 P101.2 P102.2 Q101.2(S) R106.1 R108.1 R114.1 R115.1 R116.1 R118.2 SW100.3 SW100.4 U100.8(VSSA) U100.23(VSS1) U100.35(VSS2) U100.47(VSS3) U101.3(GND)
P3.3V_UC: C102.1 C103.1 C104.1 C106.1 C107.1 C112.2 C113.2 C115.1 D100.1(A) J101.1 L100.2 P100.1 P100.2 R109.2 R110.2 R111.2 R112.2 R113.2 R117.1 R119.2 U100.9(VDDA) U100.24(VDD1) U100.36(VDD2) U100.48(VDD3) U101.2(VA)
ADC_IN5: J103.1 P102.1 U100.15(PA5)
ADC_IN6: J104.1 U100.16(PA6)
ADC_IN7: J105.1 U100.17(PA7)
ANA_METER: J102.1 P101.1 U100.14(PA4) U101.1(VOUT)
CHG_ACOK: U100.29(PA8)
CHG_ALERT: U100.25(PB12)
CHG_CE: U100.33(PA12)
CHG_CRIT: U100.10(PA0-WKUP)
CHG_ICOUT: U100.18(PB0)
CHG_MASTERPWR: Q101.1(G) R108.2 U100.28(PB15)
CHG_PWRSWITCH: C116.2 R119.1 SW100.1 SW100.2 U100.27(PB14)
CHG_SCL: U100.21(PB10) U101.5(SCL)
CHG_SDA: U100.22(PB11) U101.4(SDA)
CHG_SYS: C100.1 Q100.1(S) Q100.2(S) Q100.3(S) R104.2
GG_SYSPRES: U100.32(PA11)
HOST_TO_PM_UART: R101.1 R109.1 U100.31(PA10)
PM_JRST: P100.3 R113.1 U100.40(PB4/JNTRST)
PM_JTCK: J101.4 P100.9 R114.2 U100.37(PA14/JTCK/SWCLK)
PM_JTDI: P100.5 R112.1 U100.38(PA15/JTDI)
PM_JTDO: P100.13 U100.39(PB3/JTDO)
PM_JTMS: J101.3 P100.7 R111.1 U100.34(PA13/JTMS/SWDIO)
PM_NRST: C114.1 J101.2 P100.15 R103.1 U100.7(NRST)
PM_OSC32_IN: C110.1 U100.3(PC14-OSC32-IN) Y100.2(OSC2)
PM_OSC32_OUT: C111.1 U100.4(PC15-OSC32-OUT) Y100.1(OSC1)
PM_REFLASH_ALRT: R102.1 R106.2 U100.44(BOOT0) U100.45(PB8)
PM_TO_HOST_UART: R100.1 R110.1 U100.30(PA9)
PM_VBAT: C109.1 D100.2(K) R107.2 U100.1(VBAT)
PWR_TO_HOST: C101.1 J100.1(+12V) J100.2(+12V) J100.3(+12V) Q100.5(D) Q100.6(D) Q100.7(D) Q100.8(D)
NetC100_2: C100.2 Q100.4(G) R104.1 R105.2
NetC108_1: C108.1 R107.1
NetJ100_17: J100.17(B+) R103.2
NetJ100_18: J100.18(B-) R102.2
NetJ100_20: J100.20(A-) R101.2
NetJ100_21: J100.21(A+) R100.2
NetP100_19: P100.19 R115.2
NetQ101_3: Q101.3(D) R105.1
NetR116_2: R116.2 U100.20(PB2/BOOT1)
NetR117_2: R117.2 R118.1 U101.6(ADR0)

Not connected (* = marked no-connect by the designer): J100 7(+5V) 8(+5V) 9(+5V) 13(+3.3V) 14(+3.3V) 15(+3.3V); P100 4 17; U100 2(PC13-TAMPER-RTC) 5(PD0-OSC_IN)* 6(PD1-OSC_OUT) 11(PA1) 12(PA2) 13(PA3) 19(PB1) 26(PB13) 41(PB5) 42(PB6) 43(PB7) 46(PB9)

### Notes on the sheet
- SATA connector arrangement
- female
- male
- HD
- (near J101) Programming Header
- (near J101) 0.1" Pads / Pins
- Charger
- Mainboard
- System output voltage: 9 - 18V (3 or 4 cell Li-Ion)
- uses M-F extender combo cables
- (near U100) compatible with:  STM32F100C4T6B
- PM_REFLASH_ALRT behavior:
  On reset, samples value. If high, uC enters program mode.
  On run, output is driven. If driven high, error condition is asserted to CPU
- PA11
- PA12
- USART1
- (near R119) PA8
- Critical functions for microcontroller:
  1. Respond to CHG_CRIT with shutdown of system and charging (CHG_MASTERPWR/CHG_CE).
  2. Make sure chemistry and battery cell configuration is correctly programmed into charger.
- ADC_IN4 (101C8) / DAC1 (100C4)
- (near R116) PB0
- (near R116) BOOT1 tied to 0
- (near R116) If BOOT0 = 1, enable update of PM FLASH!
- (near R116) (overcurrent warning)
- (in symbol Si4435DY) P

### Library data of the parts
C100-C107 C109 C112-C116 = Cap Semi: Capacitor (Semiconductor SIM Model); Published: 8-Jun-2000; LatestRevisionDate: 17-Jul-2002; LatestRevisionNote: Re-released for DXP Platform.; PackageReference: C1206; Publisher: Altium Limited
C108 = Cap Pol3: Taiyo Yuden PAS414HR-VA5R; Published: 8-Jun-2000; LatestRevisionDate: 17-Jul-2002; LatestRevisionNote: Re-released for DXP Platform.; PackageReference: C0805; Publisher: Altium Limited
C110 C111 = CAP NP: Right: 20; Bottom: 10
D100 = D Schottky: Schottky Diode; Code - JEDEC: DO-214-AA; Published: 8-Jun-2000; Publisher: Altium Limited; Revision: July-2002: Re-released for DXP Platform.
J100 = SATA_22P_HEADER: SATA+Power connector
J101 = Header 5: Header, 5-Pin; LatestRevisionDate: 17-Jul-2002; LatestRevisionNote: Re-released for DXP Platform.; Publisher: Altium Limited
J102-J105 = CON1: Connector
L100 = Inductor Iron: Magnetic-Core Inductor; Published: 24-Mar-1999; LatestRevisionDate: 17-Jul-2002; LatestRevisionNote: Re-released for DXP Platform.; PackageReference: AXIAL-0.9; Publisher: Altium Limited
N100 = NOTE: Placeholder for non-electrical BOM items
P100 = Header 10X2: Header, 10-Pin, Dual row; LatestRevisionDate: 17-Jul-2002; LatestRevisionNote: Re-released for DXP Platform.; Publisher: Altium Limited
P101 P102 = Header 2H: Header, 2-Pin, Right Angle; LatestRevisionDate: 17-Jul-2002; LatestRevisionNote: Re-released for DXP Platform.; Publisher: Altium Limited
Q100 = Si4435DY: Singre P-channel FET, 8A, 30V
Q101 = MOSFET-N: N-Channel MOSFET; Published: 8-Jun-2000; LatestRevisionDate: 17-Jul-2002; LatestRevisionNote: Re-released for DXP Platform.; PackageVersion: 1995/1996; PackageReference: E3; Publisher: Altium Limited
R100-R107 R109-R119 = Res1: Resistor; Value: 100k; Published: 8-Jun-2000; LatestRevisionDate: 17-Jul-2002; LatestRevisionNote: Re-released for DXP Platform.; PackageReference: AXIAL-0.3; Publisher: Altium Limited
R108 = Res1: Resistor; Published: 8-Jun-2000; LatestRevisionDate: 17-Jul-2002; LatestRevisionNote: Re-released for DXP Platform.; PackageReference: AXIAL-0.3; Publisher: Altium Limited; Value: 100k
SW100 = Header 4: Chi Fung TS-1187A; LatestRevisionDate: 17-Jul-2002; LatestRevisionNote: Re-released for DXP Platform.; Publisher: Altium Limited
U100 = STM32F103C8T6: 32-bit ARM Coretex high performance microcontroller
U101 = DAC081C81CIMK: Single 8-bit DAC for I2C bus
Y100 = XTAL: Crystal Oscillator; Published: 8-Jun-2000; LatestRevisionDate: 17-Jul-2002; LatestRevisionNote: Re-released for DXP Platform.; PackageReference: R38; Publisher: Altium Limited

## Nets that join several sheets
CHG_VREF: charger (C214.1 R217.1 U200.7), controller (C105.1 L100.1)
GND: charger (31 pins), battery (33 pins), controller (51 pins)
P3.3V_UC: charger (7 pins), controller (25 pins)
BAT_PROTECTED: charger (10 pins), battery (8 pins)
CHG_ACOK: charger (6 pins), controller (U100.29)
CHG_ALERT: battery (R326.2), controller (U100.25)
CHG_CE: charger (R220.2 U200.13), controller (U100.33)
CHG_CRIT: battery (U300.1), controller (U100.10)
CHG_ICOUT: charger (R216.2 R218.2 U200.23), controller (U100.18)
CHG_SCL: charger (R225.2 U200.16), battery (R329.2), controller (U100.21 U101.5)
CHG_SDA: charger (R226.2 U200.15), battery (R327.2), controller (U100.22 U101.4)
CHG_SYS: charger (16 pins), controller (5 pins)
GG_SYSPRES: battery (R324.2 R330.1 U301.15), controller (U100.32)